# Altium schematic sheet ban ve 196.SchDoc
size A4
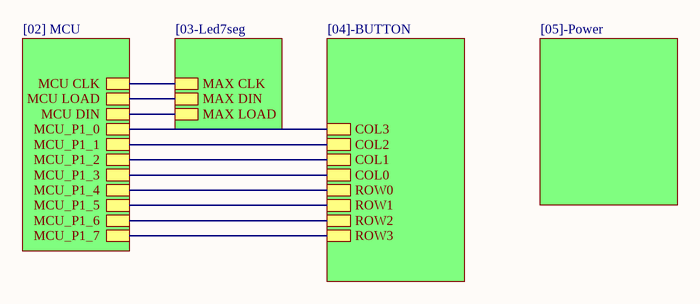
[diagram p0: ban ve 196.SchDoc]

## Sub-sheets
1 = [02] MCU: MCU CLK, MCU LOAD, MCU DIN, MCU_P1_0, MCU_P1_1, MCU_P1_2, MCU_P1_3, MCU_P1_4, MCU_P1_5, MCU_P1_6, MCU_P1_7
2 = [03-Led7seg: MAX CLK, MAX DIN, MAX LOAD
3 = [04]-BUTTON: COL3, COL2, COL1, ROW3, ROW2, COL0, ROW1, ROW0
4 = [05]-Power: no entries

## Nets
(unnamed): sheet 1/MCU CLK, sheet 2/MAX CLK
(unnamed): sheet 1/MCU LOAD, sheet 2/MAX DIN
(unnamed): sheet 1/MCU DIN, sheet 2/MAX LOAD
(unnamed): sheet 1/MCU_P1_0, sheet 3/COL3
(unnamed): sheet 1/MCU_P1_1, sheet 3/COL2
(unnamed): sheet 1/MCU_P1_2, sheet 3/COL1
(unnamed): sheet 1/MCU_P1_3, sheet 3/COL0
(unnamed): sheet 1/MCU_P1_4, sheet 3/ROW0
(unnamed): sheet 1/MCU_P1_5, sheet 3/ROW1
(unnamed): sheet 1/MCU_P1_6, sheet 3/ROW2
(unnamed): sheet 1/MCU_P1_7, sheet 3/ROW3